# EAGLE design i2c-expander (EAGLE 6.6.0)
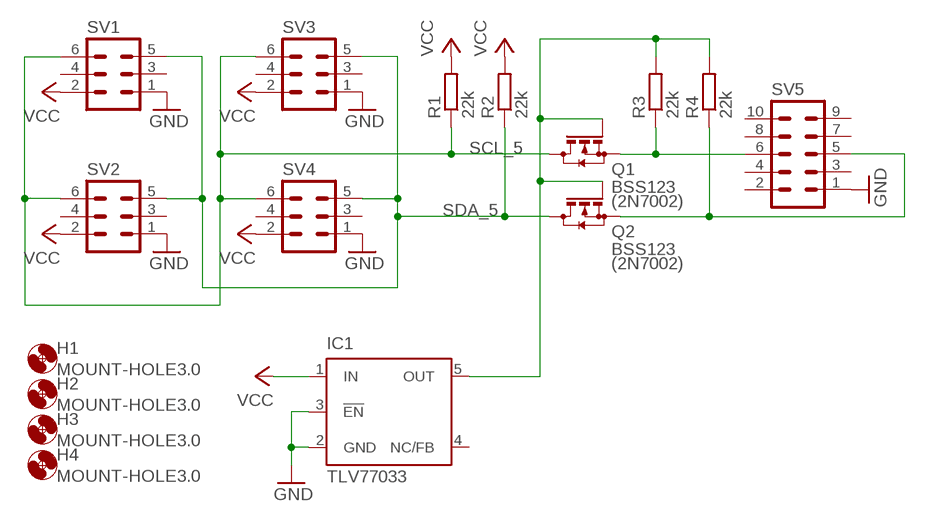
[diagram p0: schematic, sheet 1]

## Parts
H1  MOUNT-HOLE3.0  [3,0]
H2  MOUNT-HOLE3.0  [3,0]
H3  MOUNT-HOLE3.0  [3,0]
H4  MOUNT-HOLE3.0  [3,0]
IC1  TLV77033  TPS77033  [SOT23-DBV]
Q1  BSS123  [SOT23]
Q2  BSS123  [SOT23]
R1  22k  R-EU_M0805  [M0805]
R2  22k  R-EU_M0805  [M0805]
R3  22k  R-EU_M0805  [M0805]
R4  22k  R-EU_M0805  [M0805]
SV1  ML6  [ML6]
SV2  ML6  [ML6]
SV3  ML6  [ML6]
SV4  ML6  [ML6]
SV5  ML10  [ML10]

## Nets
GND: IC1.2(GND) IC1.3(!EN) SV1.1 SV2.1 SV3.1 SV4.1 SV5.1
N$1: Q1.2(S) R3.1 SV5.6
N$3: Q2.2(S) R4.1 SV5.5
N$4: IC1.5(OUT) Q1.1(G) Q2.1(G) R3.2 R4.2
SCL_5: Q1.3(D) R1.1 SV1.6 SV2.6 SV3.6 SV4.6
SDA_5: Q2.3(D) R2.1 SV1.5 SV2.5 SV3.5 SV4.5
VCC: IC1.1(IN) R1.2 R2.2 SV1.2 SV2.2 SV3.2 SV4.2
Unconnected: IC1.4(NC/FB) SV1.3 SV1.4 SV2.3 SV2.4 SV3.3 SV3.4 SV4.3 SV4.4 SV5.2 SV5.3 SV5.4 SV5.7 SV5.8 SV5.9 SV5.10

## Notes on the sheet
- (2N7002)
- (2N7002)

## Library data of the parts
H1-H4 = holes:MOUNT-HOLE: MOUNTING HOLE with drill center marker
IC1 = texas:TPS770*: ULTRALOW-POWER 50-mA LOW-DROPOUT LINEAR REGULATORS 50-mA Low-Dropout Regulator Source: http://focus.ti.com/lit/ds/symlink/tps77001.pdf; MF: TEXAS INSTRUMENTS; MPN: TPS77033DBVT; OC_FARNELL: 8461570; OC_NEWARK: 77C1187
Q1 Q2 = transistor-small-signal:BSS123: N-CHANNEL MOS FET
R1-R4 = rcl:R-EU_: RESISTOR, European symbol
SV1-SV4 = con-ml:ML6: HARTING; OC_FARNELL: unknown; OC_NEWARK: unknown
SV5 = con-ml:ML10: HARTING; OC_FARNELL: unknown; OC_NEWARK: unknown

## Board
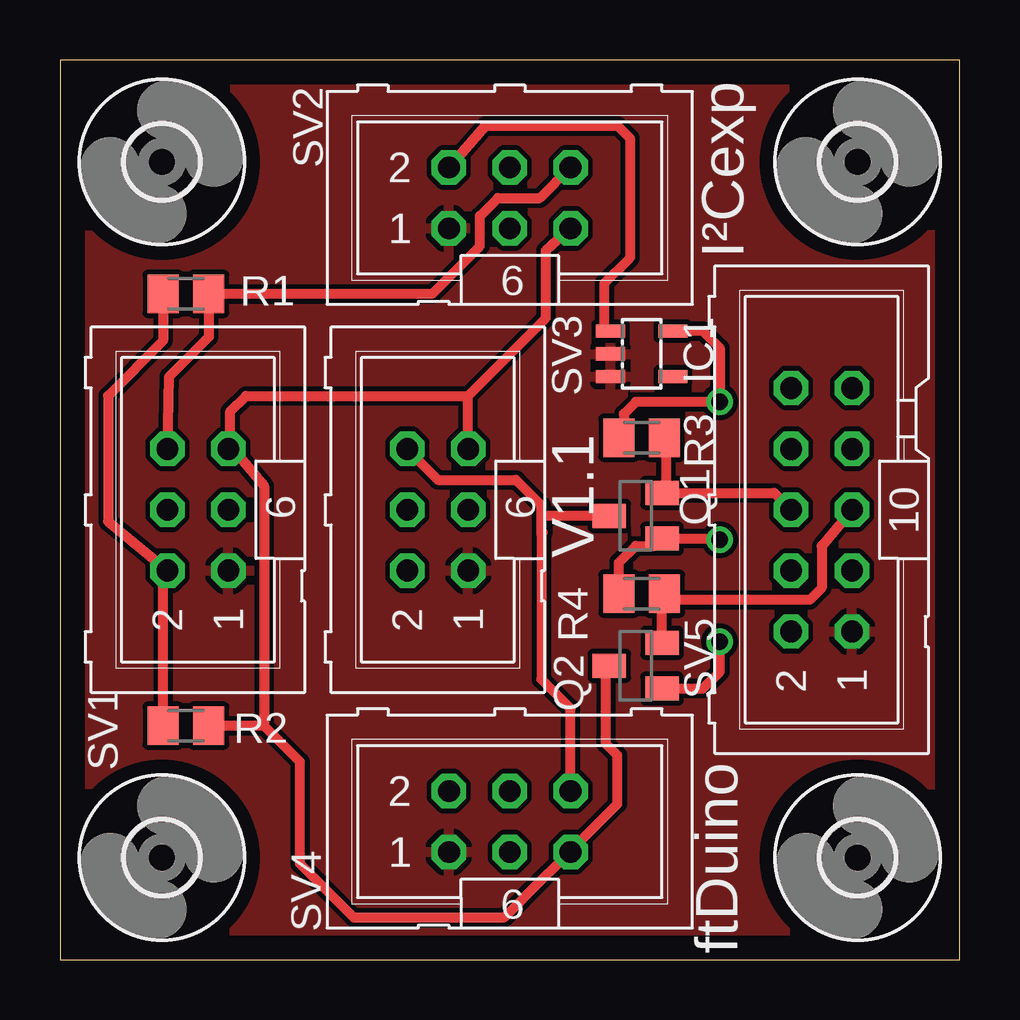
[diagram p1: board, top side]
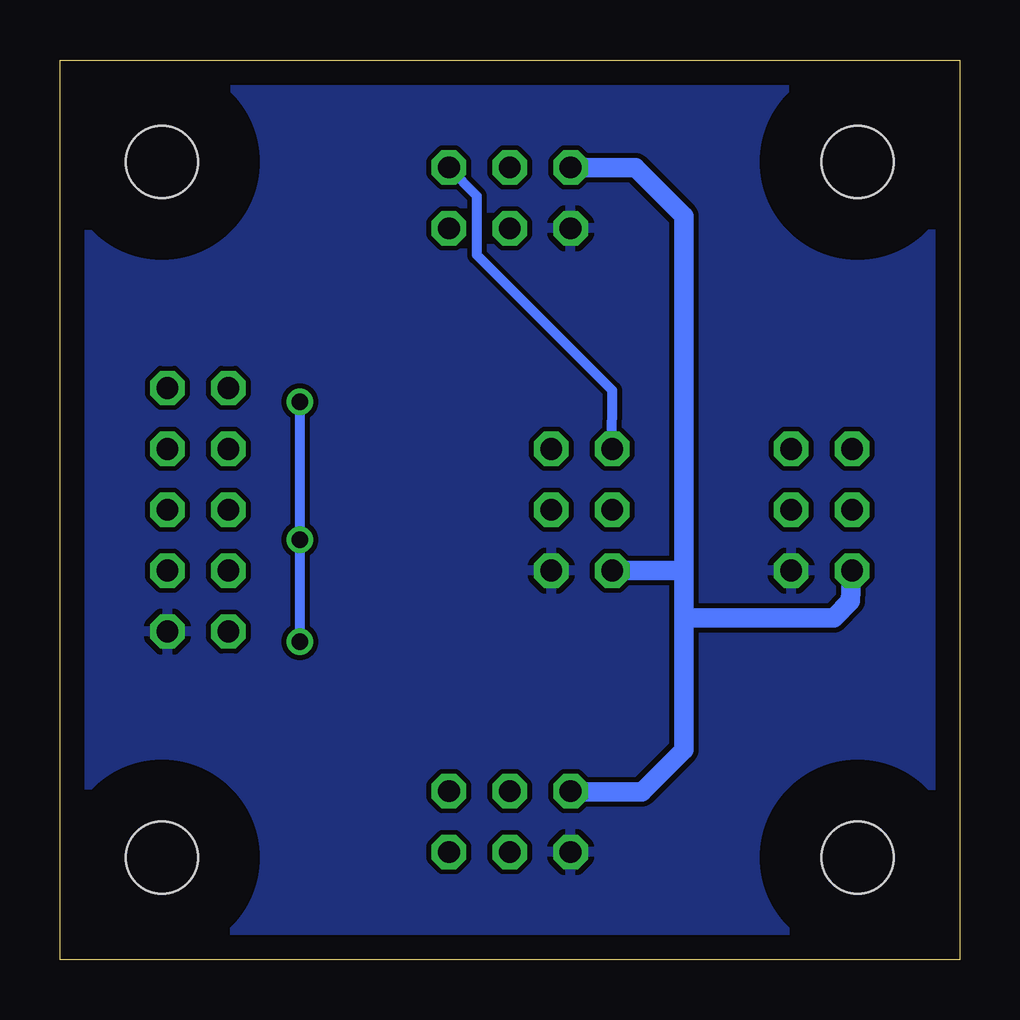
[diagram p2: board, bottom side, seen from below]

Size 37.5 x 37.5 mm. Coordinates in mm from the lower left corner, seen from the top.
Outline: 0,0 37.5,0 37.5,37.5 0,37.5 0,0
Copper layers (1*16): Top 0.035mm / dielectric 1.5mm / Bottom 0.035mm
Design rules "default": minimum track width 10mil, minimum drill 24mil, track to track 8mil, track to pad 8mil, pad to pad 8mil, via to via 8mil, smd to smd 8mil, copper to edge 40mil, drill to drill 8mil, minimum pad ring 10mil, minimum via ring 8mil, stop-mask expansion 4mil, vias tented up to drill 0mil, thermal gap 10mil

### Footprints (pad centres in the part's own frame; a part is rotated, then mirrored left to right if it is on the bottom)
3,0 = hole 3: 0,0
SOT23-DBV = smd 0.55 x 1.2: 1 -0.95,-1.3; 2 0,-1.3; 3 0.95,-1.3; 4 0.95,1.3; 5 -0.95,1.3
SOT23 = smd 1 x 1.4: 1 -0.95,-1.1; 2 0.95,-1.1; 3 0,1.1
M0805 = smd 1.3 x 1.6: 1 -0.95,0; 2 0.95,0
ML6 = drill 0.914 octagon: 1 -2.54,-1.27; 2 -2.54,1.27; 3 0,-1.27; 4 0,1.27; 5 2.54,-1.27; 6 2.54,1.27
ML10 = drill 0.914 octagon: 1 -5.08,-1.27; 2 -5.08,1.27; 3 -2.54,-1.27; 4 -2.54,1.27; 5 0,-1.27; 6 0,1.27; 7 2.54,-1.27; 8 2.54,1.27; 9 5.08,-1.27; 10 5.08,1.27

### Placement (x,y rotation side)
H1  33.25,4.25 0 top
H2  4.25,4.25 0 top
H3  33.25,33.25 0 top
H4  4.25,33.25 0 top
IC1  24.25,25.25 270 top
Q1  24,18.5 90 top
Q2  24,12.25 90 top
R1  5.25,27.75 180 top
R2  5.25,9.75 180 top
R3  24.25,21.75 180 top
R4  24.25,15.25 180 top
SV1  5.75,18.75 90 top
SV2  18.75,31.75 0 top
SV3  15.75,18.75 90 top
SV4  18.75,5.75 0 top
SV5  31.75,18.75 90 top

### Tracks (layer width: path | path; a pad name or v marks a point on that pad's centre or on a via)
GND
  pour Bottom: 0,0 0,37.5 37.5,37.5 37.5,0
  pour Top: 0,0 0,37.5 37.5,37.5 37.5,0
N$1
  Top 0.406: R3.1 25.27,21.18 25.27,19.62 Q1.2 29.78,19.45 SV5.6 30.45,18.77
N$3
  Top 0.406: SV5.5 33,18.75 31.75,17.25 31.75,15.5 31.25,15 25.45,15 R4.1 25.27,14.68 25.1,14.52 Q2.2
N$4  (via drill 0.7)
  Top 0.406: R3.2 23.5,21.45 23.5,22.75 24,23.25 v27.5,23.25 27.5,25.5 26.8,26.2 IC1.5 | R4.2 23.3,16.55 24,17.25 24.8,17.25 Q1.1 27.5,17.55 v27.5,17.5 | Q2.1 26.8,11.3 27.5,12 v27.5,13.25
  Bottom 0.406: v27.5,23.25 v27.5,17.5 v27.5,13.25
SCL_5
  Top 0.406: SV3.6 15.75,20 19,20 20.07,18.93 20.07,18.5 | SV4.6 21.29,10.46 20.07,11.68 20.07,17.75 | 20.07,17.75 20.07,18.5 | SV1.6 4.56,24.31 6.2,25.95 R1.1 15.5,27.75 17.5,29.75 17.5,31 18.25,31.75 20,31.75 21.27,33.02 SV2.6 | 20.13,17.81 20.07,17.75 | Q1.3 20.07,18.5
  Bottom 0.406: SV3.6 14.47,23.72 20.12,29.38 20.12,31.82 SV2.6
SDA_5
  Top 0.406: 7.1,21.35 7.1,22.85 7.75,23.5 17,23.5 | 17,23.5 20.25,26.75 20.25,29.55 SV2.5 | SV3.5 17.01,23.49 17,23.5 | SV1.5 7.1,21.35 | 8.5,9.75 8.5,19.75 7.15,21.35 7.1,21.35 | 6.25,9.8 R2.1 8.5,9.75 | 8.5,9.75 10,8.25 10,4 12.25,1.75 18.5,1.75 20.07,3.32 SV4.5 21.73,4.98 23.23,6.48 23.23,8.52 22.75,9 22.75,12.1 Q2.3
VCC
  Top 0.406: R1.2 4.3,25.8 2,23.5 2,18.27 SV1.2 4.3,15.97 R2.2 | IC1.1 22.7,26.2 22.7,28.2 23.75,29.25 23.75,34.25 23.25,34.75 17.72,34.75 SV2.2
  Bottom 0.813: SV2.2 13.52,33.02 11.5,31 11.5,16.25 | 11.5,16.25 11.5,14 | 11.5,14 11.5,8.75 13.25,7 16.19,7 SV4.2 | SV3.2 11.54,16.21 11.5,16.25 | 11.5,14 11.25,14.25 5.25,14.25 4.56,14.94 SV1.2

### Text on the board
tPlace: I²Cexp | V1.1 | ftDuino